# Altium schematic sheet Front Panel Header.SchDoc: Front Panel Connector
size A4; SheetNumber: 2; SheetTotal: 10
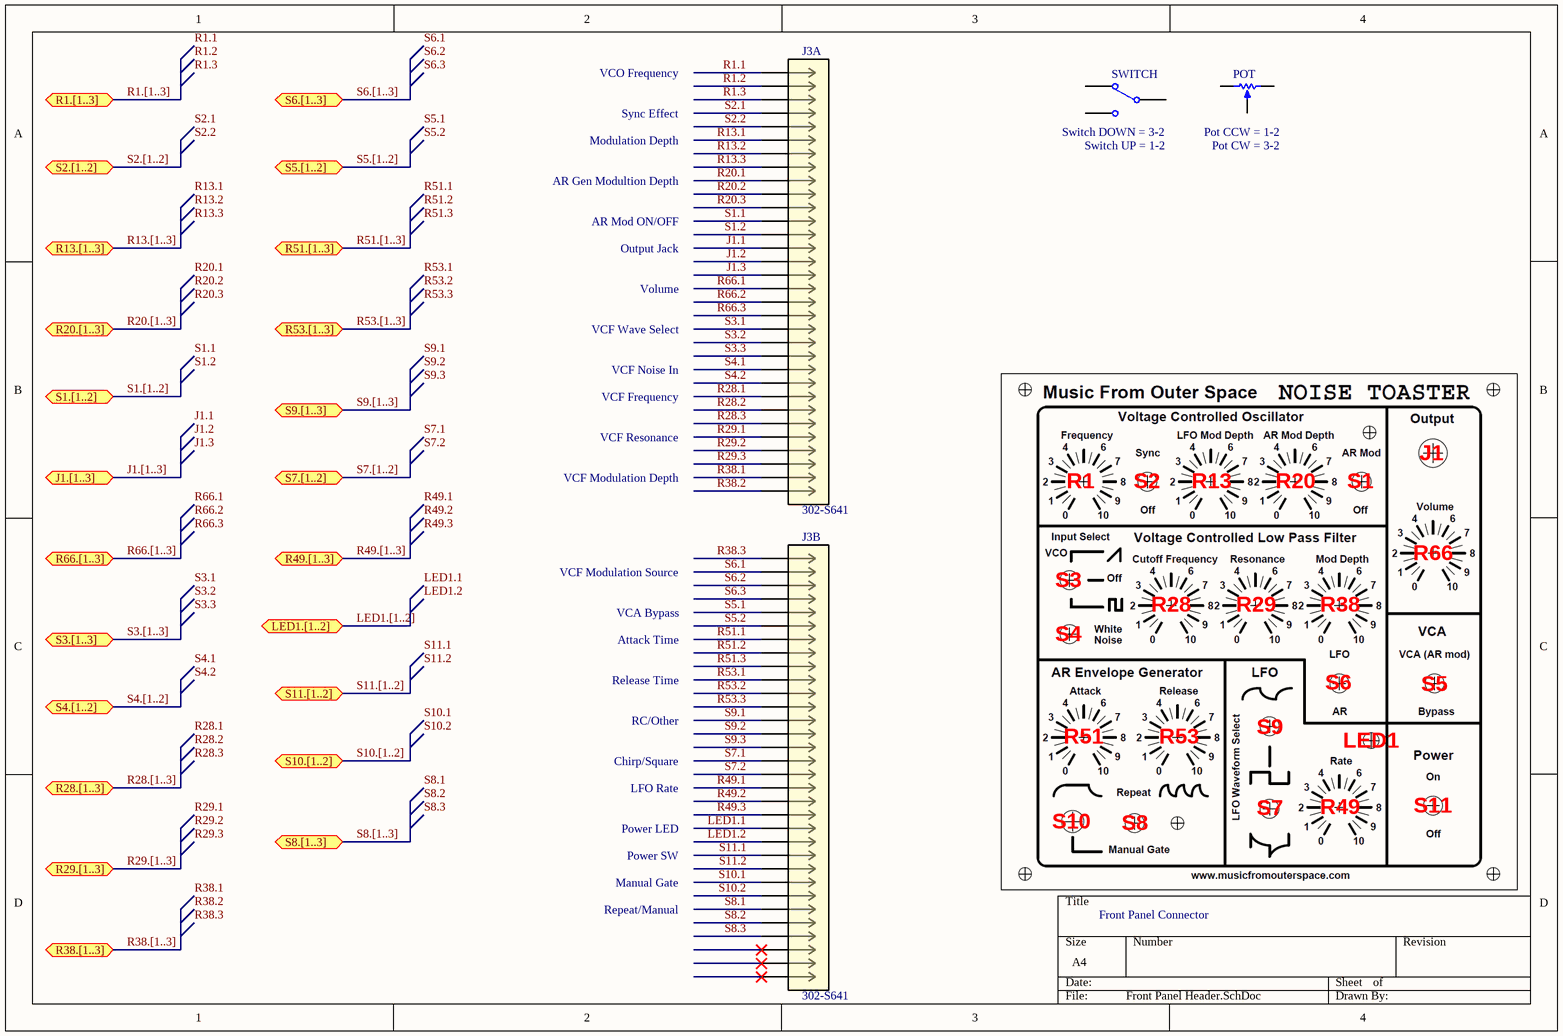
[diagram p0: Front Panel Header.SchDoc]

## Parts
J3  302-S641  [CONN_302-S641_OST]  (parts A,B of 2)
POT  (no value)  [VR5]  (graphical)
SWITCH  (no value)  [HDR1X3]  (graphical)

## Ports
J1.[1..3] (bidir), LED1.[1..2] (bidir), R1.[1..3] (bidir), R13.[1..3] (bidir), R20.[1..3] (bidir), R28.[1..3] (bidir), R29.[1..3] (bidir), R38.[1..3] (bidir), R49.[1..3] (bidir), R51.[1..3] (bidir), R53.[1..3] (bidir), R66.[1..3] (bidir), S1.[1..2] (bidir), S2.[1..2] (bidir), S3.[1..3] (bidir), S4.[1..2] (bidir), S5.[1..2] (bidir), S6.[1..3] (bidir), S7.[1..2] (bidir), S8.[1..3] (bidir), S9.[1..3] (bidir), S10.[1..2] (bidir), S11.[1..2] (bidir)

## Nets
J1.1: J3.14
J1.2: J3.15
J1.3: J3.16
LED1.1: J3.53
LED1.2: J3.54
R1.1: J3.1
R1.2: J3.2
R1.3: J3.3
R13.1: J3.6
R13.2: J3.7
R13.3: J3.8
R20.1: J3.9
R20.2: J3.10
R20.3: J3.11
R28.1: J3.25
R28.2: J3.26
R28.3: J3.27
R29.1: J3.28
R29.2: J3.29
R29.3: J3.30
R38.1: J3.31
R38.2: J3.32
R38.3: J3.33
R49.1: J3.50
R49.2: J3.51
R49.3: J3.52
R51.1: J3.39
R51.2: J3.40
R51.3: J3.41
R53.1: J3.42
R53.2: J3.43
R53.3: J3.44
R66.1: J3.17
R66.2: J3.18
R66.3: J3.19
S1.1: J3.12
S1.2: J3.13
S2.1: J3.4
S2.2: J3.5
S3.1: J3.20
S3.2: J3.21
S3.3: J3.22
S4.1: J3.23
S4.2: J3.24
S5.1: J3.37
S5.2: J3.38
S6.1: J3.34
S6.2: J3.35
S6.3: J3.36
S7.1: J3.48
S7.2: J3.49
S8.1: J3.59
S8.2: J3.60
S8.3: J3.61
S9.1: J3.45
S9.2: J3.46
S9.3: J3.47
S10.1: J3.57
S10.2: J3.58
S11.1: J3.55
S11.2: J3.56

Not connected (* = marked no-connect by the designer): J3 62* 63* 64*; POT 1(TOP) 2(TAP) 3(BOT); SWITCH 1 2 3

## Buses and harness runs
bus J1.[1..3] = port J1.[1..3]
bus LED1.[1..2] = port LED1.[1..2]
bus R1.[1..3] = port R1.[1..3]
bus R13.[1..3] = port R13.[1..3]
bus R20.[1..3] = port R20.[1..3]
bus R28.[1..3] = port R28.[1..3]
bus R29.[1..3] = port R29.[1..3]
bus R38.[1..3] = port R38.[1..3]
bus R49.[1..3] = port R49.[1..3]
bus R51.[1..3] = port R51.[1..3]
bus R53.[1..3] = port R53.[1..3]
bus R66.[1..3] = port R66.[1..3]
bus S1.[1..2] = port S1.[1..2]
bus S2.[1..2] = port S2.[1..2]
bus S3.[1..3] = port S3.[1..3]
bus S4.[1..2] = port S4.[1..2]
bus S5.[1..2] = port S5.[1..2]
bus S6.[1..3] = port S6.[1..3]
bus S7.[1..2] = port S7.[1..2]
bus S8.[1..3] = port S8.[1..3]
bus S9.[1..3] = port S9.[1..3]
bus S10.[1..2] = port S10.[1..2]
bus S11.[1..2] = port S11.[1..2]

## Notes on the sheet
- VCO Frequency
- Sync Effect
- Modulation Depth
- AR Gen Modultion Depth
- (near SWITCH) Switch DOWN = 3-2
- (near SWITCH) Switch UP = 1-2
- (near POT) Pot CCW = 1-2
- (near POT) Pot CW = 3-2
- Output Jack
- AR Mod ON/OFF
- Volume
- VCF Wave Select
- VCF Noise In
- VCF Resonance
- VCF Frequency
- J1
- VCF Modulation Depth
- R1
- S2
- R13
- R20
- S1
- VCF Modulation Source
- S3
- R66
- Attack Time
- VCA Bypass
- S4
- R28
- R29
- R38
- Release Time
- RC/Other
- S6
- S5
- LFO Rate
- Chirp/Square
- R51
- R53
- S9
- LED1
- Power LED
- Power SW
- S10
- S8
- S7
- R49
- S11
- Manual Gate
- Repeat/Manual
- Labels drawn without touching a wire or pin: J1.1, J1.2, J1.3, LED1.1, LED1.2, R1.1, R1.2, R1.3, R13.1, R13.2, R13.3, R20.1, R20.2, R20.3, R28.1, R28.2, R28.3, R29.1, R29.2, R29.3, R38.1, R38.2, R38.3, R49.1, R49.2, R49.3, R51.1, R51.2, R51.3, R53.1, R53.2, R53.3, R66.1, R66.2, R66.3, S1.1, S1.2, S2.1, S2.2, S3.1, S3.2, S3.3, S4.1, S4.2, S5.1, S5.2, S6.1, S6.2, S6.3, S7.1, S7.2, S8.1, S8.2, S8.3, S9.1, S9.2, S9.3, S10.1, S10.2, S11.1, S11.2

## Library data of the parts
J3 = 302-S641: Conn Shrouded Header HDR 64 POS 2.54mm Solder ST Thru-Hole; Manufacturer_Name: On Shore Technology; Voltage Rating: 250V; Connector Type: Male Pin; Contact Resistance: 20mΩ; Number of Contacts: 64; Current Rating: 3A; Insulation Resistance: 1GΩ; REACH SVHC: Yes; Contact Material: Brass; Pitch: 2.54mm; RoHS: Compliant; Number of Rows: 2; Termination: Solder; Max Operating Temperature: 105°C; Height: 9.15mm; Min Operating Temperature: -40°C; Number of Positions: 64; Color: Black; Contact Gender: Male; Row Spacing: 2.54mm; Contact Plating: Gold; Copyright: Copyright (C) 2026 Ultra Librarian. All rights reserved.; Manufacturer_Part_Number: 302-S641; RefDes: RefDes; Type: Type; Supplier 1: DigiKey; Manufacturer: On Shore Technology; Manufacturer Part Number: 302-S641; Category: Card Edge Connectors; Stock 1: 292; Pricing 1: 1=1, 60=0.74883, 120=0.713, 540=0.64111, 1020=0.61296, 5040=0.54763, 10020=0.52174 (USD); Lifecycle Status: Production; Mounting Technology: Through Hole; Pins: 64; Terminal Pitch: 2.54mm; ComponentLink1URL: https://datasheet.octopart.com:443/302-S641-On-Shore-Technology-datasheet-138897390.pdf?src-supplier=IHS; ComponentLink1Description: https://datasheet.octopart.com:443/302-S641-On-Shore-Technology-datasheet-138897390.pdf?src-supplier=IHS; Supplier Part Number 1: ED10532-ND
POT = RPot: Potentiometer; Sim Note: Enter the Resistance value and the set point into parameter fields.; Set Position: 0.5; Published: 8-Jun-2000; LatestRevisionDate: 17-Jul-2002; LatestRevisionNote: Re-released for DXP Platform.; PackageReference: VR5; Publisher: Altium Limited; PackageDescription: Variable Resistor, Thru-Hole; 3 Leads
SWITCH = SW-SPDT: Switch Toggle ON OFF ON SPDT Round Lever Solder Lug 5A 250VAC 28VDC Panel Mount with Threads; Manufacturer: E-Switch; Manufacturer Part Number: 100SP3T1B1M1QEH; Actuator Material: Brass,Chrome; Actuator Color: Chrome; Voltage Rating (AC): 120V; Voltage Rating (DC): 28V; Illumination Type: Non-Illuminated,Illuminated; Electrical Life: 40000Cycles; Switch Function: On-Off-On; Actuator Type: Standard Round; Contact Resistance: 100mR; Max Voltage Rating (AC): 250V; Actuator Length: 10.41mm; Published: 24-Mar-1999; LatestRevisionDate: 17-Dec-2003; LatestRevisionNote: Schematic revised, PCB Footprint replaced.; DatasheetVersion: 05-Dec-2000; PackageReference: TL36WW15050; Publisher: Altium Limited; PackageDescription: Switch; 4 Leads; ComponentLink1Description: Manufacturer Link; ComponentLink1URL: http://www.apem.com; Supplier 1: Newark; Supplier Part Number 1: 16N0109; RoHS: Yes; Category: Toggle Switches; Stock 1: 100; Pricing 1: 1=3.40000, 10=3.05000, 25=2.88000, 50=2.75000, 100=2.61000, 250=2.50000 (USD); Mount: Panel; Contact Material: Copper Alloy,Silver; Contact Plating: Silver; Housing Material: Stainless Steel; Min Operating Temperature: -30°C; Max Operating Temperature: 85°C; Throw Configuration: SPDT; Package Quantity: 1; Packaging: Bulk; Termination: Solder; Orientation: Straight; Series: 100; Current Rating: 5A; Max Voltage Rating (DC): 28V; Lead Free: Lead Free; RoHS Compliant: Yes; ComponentLink2URL: https://datasheet.ciiva.com/2905/1012730000-jpg-2905501.pdf?src-supplier=Digi-Key; ComponentLink2Description: https://datasheet.ciiva.com/2905/1012730000-jpg-2905501.pdf?src-supplier=Digi-Key; ComponentLink3URL: https://datasheet.ciiva.com/24480/st113001-24480688.pdf?src-supplier=Onlinecomponents.com; ComponentLink3Description: https://datasheet.ciiva.com/24480/st113001-24480688.pdf?src-supplier=Onlinecomponents.com; ComponentLink4URL: https://datasheet.ciiva.com/16338/100-16338027.pdf?src-supplier=Future+Electronics; ComponentLink4Description: https://datasheet.ciiva.com/16338/100-16338027.pdf?src-supplier=Future+Electronics